# Altium schematic sheet Weatstone bridge part I.SchDoc: Weatstone bridge
size A4; Revision: 1; SheetNumber: 3; SheetTotal: 5
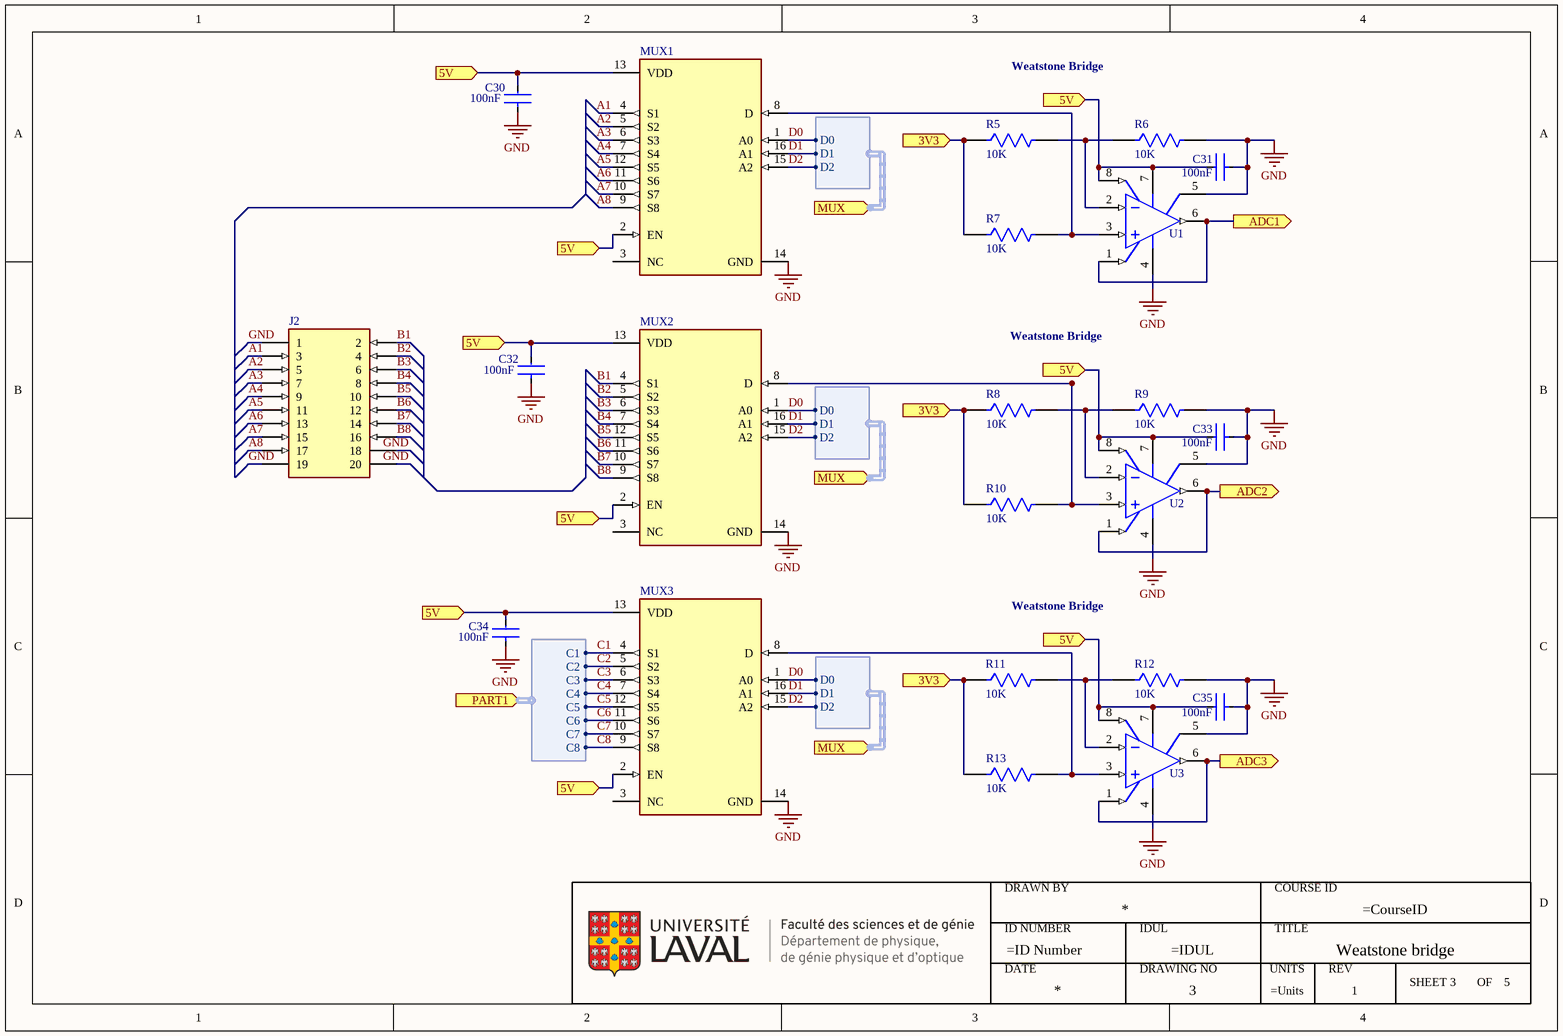
[diagram p0: Weatstone bridge part I.SchDoc]

## Parts
*3  ULaval FSG-DPGPO  (value not drawn)  (graphical)
C30  value 100nF  [FP-CC0603-DA-IPC_B]  (hidden comment: CC0603JRX7R9BB104)
C31  value 100nF  [FP-CC0603-DA-IPC_B]  (hidden comment: CC0603JRX7R9BB104)
C32  value 100nF  [FP-CC0603-DA-IPC_B]  (hidden comment: CC0603JRX7R9BB104)
C33  value 100nF  [FP-CC0603-DA-IPC_B]  (hidden comment: CC0603JRX7R9BB104)
C34  value 100nF  [FP-CC0603-DA-IPC_B]  (hidden comment: CC0603JRX7R9BB104)
C35  value 100nF  [FP-CC0603-DA-IPC_B]  (hidden comment: CC0603JRX7R9BB104)
J2  SFC-110-T1-F-D-A  [SFC-110-T1-F-D-A-Footprint-2]  (value not drawn)
MUX1  TMUX1208PWR  [FP-PW0016A-IPC_B]  (value not drawn)
MUX2  TMUX1208PWR  [FP-PW0016A-IPC_B]  (value not drawn)
MUX3  TMUX1208PWR  [FP-PW0016A-IPC_B]  (value not drawn)
R5  value 10K  [FP-RT0603-IPC_B]  (hidden comment: RT0603BRD0710KL)
R6  value 10K  [FP-RT0603-IPC_B]  (hidden comment: RT0603BRD0710KL)
R7  value 10K  [FP-RT0603-IPC_B]  (hidden comment: RT0603BRD0710KL)
R8  value 10K  [FP-RT0603-IPC_B]  (hidden comment: RT0603BRD0710KL)
R9  value 10K  [FP-RT0603-IPC_B]  (hidden comment: RT0603BRD0710KL)
R10  value 10K  [FP-RT0603-IPC_B]  (hidden comment: RT0603BRD0710KL)
R11  value 10K  [FP-RT0603-IPC_B]  (hidden comment: RT0603BRD0710KL)
R12  value 10K  [FP-RT0603-IPC_B]  (hidden comment: RT0603BRD0710KL)
R13  value 10K  [FP-RT0603-IPC_B]  (hidden comment: RT0603BRD0710KL)
U1  MCP6N11-100E/SN  [MCP6N11-100E/SN]  (value not drawn)
U2  MCP6N11-100E/SN  [MCP6N11-100E/SN]  (value not drawn)
U3  MCP6N11-100E/SN  [MCP6N11-100E/SN]  (value not drawn)

## Ports
3V3 (in), 5V (in), ADC1 (out), ADC2 (out), ADC3 (out), MUX (in, harness *), PART1 (in, harness J2)

## Harnesses
*: D0, D1, D2
J2: C1, C2, C3, C4, C5, C6, C7, C8

## Nets
GND: C30.1 C31.1 C32.1 C33.1 C34.1 C35.1 J2.1 J2.18 J2.19 J2.20 MUX1.14(GND) MUX2.14(GND) MUX3.14(GND) R6.2 R9.2 R12.2 U1.4(VSS) U1.5(VREF) U2.4(VSS) U2.5(VREF) U3.4(VSS) U3.5(VREF)
3V3: R5.1 R7.1 R8.1 R10.1 R11.1 R13.1 ; port 3V3
5V: C30.2 C31.2 C32.2 C33.2 C34.2 C35.2 MUX1.2(EN) MUX1.13(VDD) MUX2.2(EN) MUX2.13(VDD) MUX3.2(EN) MUX3.13(VDD) U1.7(VDD) U1.8(EN/~{CAL}) U2.7(VDD) U2.8(EN/~{CAL}) U3.7(VDD) U3.8(EN/~{CAL}) ; port 5V
A1: J2.3 MUX1.4(S1)
A2: J2.5 MUX1.5(S2)
A3: J2.7 MUX1.6(S3)
A4: J2.9 MUX1.7(S4)
A5: J2.11 MUX1.12(S5)
A6: J2.13 MUX1.11(S6)
A7: J2.15 MUX1.10(S7)
A8: J2.17 MUX1.9(S8)
ADC1: U1.1(VFG) U1.6(VOUT) ; port ADC1
ADC2: U2.1(VFG) U2.6(VOUT) ; port ADC2
ADC3: U3.1(VFG) U3.6(VOUT) ; port ADC3
B1: J2.2 MUX2.4(S1)
B2: J2.4 MUX2.5(S2)
B3: J2.6 MUX2.6(S3)
B4: J2.8 MUX2.7(S4)
B5: J2.10 MUX2.12(S5)
B6: J2.12 MUX2.11(S6)
B7: J2.14 MUX2.10(S7)
B8: J2.16 MUX2.9(S8)
C1: MUX3.4(S1) ; port PART1.C1
C2: MUX3.5(S2) ; port PART1.C2
C3: MUX3.6(S3) ; port PART1.C3
C4: MUX3.7(S4) ; port PART1.C4
C5: MUX3.12(S5) ; port PART1.C5
C6: MUX3.11(S6) ; port PART1.C6
C7: MUX3.10(S7) ; port PART1.C7
C8: MUX3.9(S8) ; port PART1.C8
D0: MUX1.1(A0) MUX2.1(A0) MUX3.1(A0) ; port MUX.D0
D1: MUX1.16(A1) MUX2.16(A1) MUX3.16(A1) ; port MUX.D1
D2: MUX1.15(A2) MUX2.15(A2) MUX3.15(A2) ; port MUX.D2
NetMUX1_8: MUX1.8(D) R7.2 U1.3(VIP)
NetMUX2_8: MUX2.8(D) R10.2 U2.3(VIP)
NetMUX3_8: MUX3.8(D) R13.2 U3.3(VIP)
NetR5_2: R5.2 R6.1 U1.2(VIM)
NetR8_2: R8.2 R9.1 U2.2(VIM)
NetR11_2: R11.2 R12.1 U3.2(VIM)

Not connected (* = marked no-connect by the designer): MUX1 3(NC); MUX2 3(NC); MUX3 3(NC)

## Notes on the sheet
- Weatstone Bridge
- (in symbol ULaval FSG-DPGPO) DRAWN BY; COURSE ID; ID NUMBER; IDUL; TITLE; DATE; DRAWING NO; UNITS; REV; SHEET; OF

## Library data of the parts
C30-C35 = CMP-001-00097-1: 0603 0.1 uF 50 V ±5 % Tolerance X7R SMT Multilayer Ceramic Capacitor; Voltage Rating: 50V; Tolerance: 5%; Halogen Free: Halogen Free; Depth: 0.8mm; Case/Package: 0603; Dielectric: X7R; Thickness: 0.035inch; Series: CC; Termination: SMD/SMT; Voltage Rating (DC): 50V; Max Operating Temperature: 125°C; Weight: 7.1E-05oz; Construction: Flat; Resistor Type: Ceramic; Height: 0.8mm; Length: 0.063inch; RoHS Compliant: Yes; Lead Free: Lead Free; Pins: 2; Min Operating Temperature: -55°C; Case Code (Imperial): 0603; Radiation Hardening: No; Case Code (Metric): 1608; Mounting Technology: Surface Mount; Width: 0.031inch; Packaging: Tape and Reel
J2 = CMP-002-00080-2: Headers & Wire Housings .050 Tiger Eye Cost-Effective Reliable Socket Strip; Pitch: 0.05inch; Voltage Rating (AC): 350V; Connector Type: Receptacle; Number of Contacts: 20; Gender: Female; Insulation Color: Black; Max Operating Temperature: 125°C; Min Operating Temperature: -55°C; Insulation Material: Polymer; RoHS Compliant: Yes; Row Spacing: 0.05inch; Number of Rows: 2; Contact Shape: Square; Contact Type: Female Socket; Mounting Technology: Through Hole; Termination: Solder; Fastening Type: Pull; Contact Finish - Mating: GOLD; Color: Black; Packaging: Rail/Tube; Contact Material: Bronze; Contact Plating: Gold; Number of Positions: 20; Series: Tiger Eye™ SFC
MUX1-MUX3 = CMP-015-00012-1: 5-V, 8: 1, 1-channel general-purpose analog multiplexer with 1.8-V input logic 16-TSSOP -40 to 125; RoHS Compliant: Yes
R5-R13 = CMP-009-00178-1: Res High precision Thin Film 0603 10K Ohm 0.1% 1/10W ±25ppm/°C Molded SMD Paper T/R; Max Power Dissipation: 100mW; Working Voltage: 75V; RoHS Compliant: Yes; Power Rating: 100mW; Lead Free: Lead Free; Depth: 0.8mm; Case Code (Imperial): 0603; Max Operating Temperature: 155°C; Voltage Rating: 75V; Package Quantity: 5000; Packaging: Tape and Reel; Case/Package: 0603; Height: 0.022inch; Construction: Rectangular; Min Operating Temperature: -55°C; Termination: SMD/SMT; Features: Moisture Resistant; Number of Terminations: 2; Case Code (Metric): 1608; Technology: THIN FILM; Military Standard: Not; Length: 0.063inch; Voltage Rating (DC): 75V; Temperature Coefficient: 25ppm/°C; Weight: 7.1E-05oz; Width: 0.8mm; Series: RT; Resistor Type: Thin Film
U1-U3 = CMP-014-00010-7: MCP6N11 Series Single Channel 500 KHz 5.5 V Instrumentation Amplifier - SOIC-8; Bandwidth: 500kHz; Min Supply Voltage: 1.8V; Number of Elements: 2; Gain Bandwidth Product: 35MHz; Input Offset Voltage (Vos): 350uV; Number of Channels: 1; Nominal Supply Current: 800uA; Common Mode Rejection Ratio: 86dB; Slew Rate: 6V/µs; Max Supply Voltage: 5.5V; Slew Rate-Nom: 9V/µs; Input Bias Current: 10pA; Mounting Technology: Surface Mount; Package Quantity: 100; Pins: 8; Width: 3.9mm; Length: 4.9mm; Case/Package: SOIC; Min Operating Temperature: -40°C; Radiation Hardening: No; RoHS Compliant: Yes; Unity Gain Bandwidth Product: 35MHz; Lead Free: Lead Free; Number of Amplifiers: 1; Max Operating Temperature: 125°C; Height: 1.25mm; Packaging: Rail/Tube; Input Offset Voltage-Max: 350uV; Reach SVHC Compliant: Yes; Supply Current: 800uA; Max Supply Current: 800uA; Power Supply Rejection Ratio (PSRR): 86dB; Number of Circuits: 1